# Altium project PCB_Project.PrjPcb
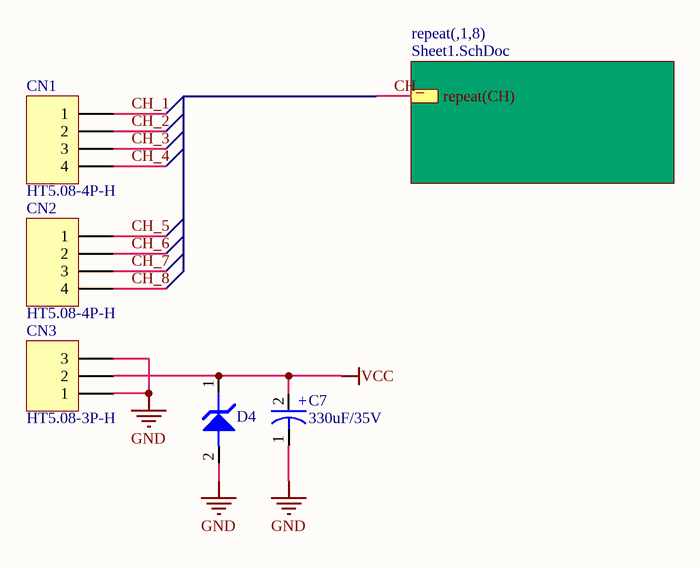
[diagram p0: Sheet2.SchDoc]
2 sheets, 69 parts. Net scope: hierarchical (ports join the sheet entries above them; power ports are global).
Board file: PCB1.PcbDoc
Sheets:
  Sheet2.SchDoc
    1 = Sheet1.SchDoc
    2 = Sheet1.SchDoc
    3 = Sheet1.SchDoc
    4 = Sheet1.SchDoc
    5 = Sheet1.SchDoc
    6 = Sheet1.SchDoc
    7 = Sheet1.SchDoc
    8 = Sheet1.SchDoc

## Sheet Sheet2.SchDoc
size A4

### Parts
C7  value 330uF/35V  [CA10X16P5]  (hidden comment: CAPACITOR 330uF 20% 35V 10mmX16mm)
CN1  HT5.08-4P-H  [HT5.08-4P-H]
CN2  HT5.08-4P-H  [HT5.08-4P-H]
CN3  HT5.08-3P-H  [HT5.08-3P-H]
D4  SMAJ5.0A  [SMA]  (value not drawn)

### Sub-sheets
repeat(,1,8) = Sheet1.SchDoc: repeat(CH)

### Nets
GND: C7.1 CN3.1 CN3.3 D4.2
VCC: C7.2 CN3.2 D4.1
CH_: sheet repeat(,1,8)/repeat(CH)
CH_1: CN1.1
CH_2: CN1.2
CH_3: CN1.3
CH_4: CN1.4
CH_5: CN2.1
CH_6: CN2.2
CH_7: CN2.3
CH_8: CN2.4

### Notes on the sheet
- (in symbol EC00095) +

### Library data of the parts
C7 = EC00095: CAP 35V 20% 330uF 10X16X0.6MM ROHS，7000hours; Manufacturer: NIPPON CHEMI-CON; Manufacturer P/N: EKY350ELL331MJ16S; ID: 95; Type: ****; HelpURL: \\192.168.1.3\Esh\Department\RD\CAD\Component\Capacitor\KY(105).pdf; P/N: EC00095
CN1 CN2 = Header 4: Header, 4-Pin; Manufacturer P/N: HT5.08-4 Bend; P/N: EE00005; Manufacturer: *
CN3 = Header 3: Header, 3-Pin; LatestRevisionDate: 17-Jul-2002; LatestRevisionNote: Re-released for DXP Platform.; Publisher: Altium Limited
D4 = ED00032: Manufacturer P/N: SMBJ15A; Manufacturer: Bourns; P/N: EE00002; Value: SMBJ15A; Type: ****

## Sheet Sheet1.SchDoc
size A4
Used 8 times, as channels 1, 2, 3, 4, 5, 6, 7, 8. Parts and nets are listed once, with the designators drawn on the sheet.
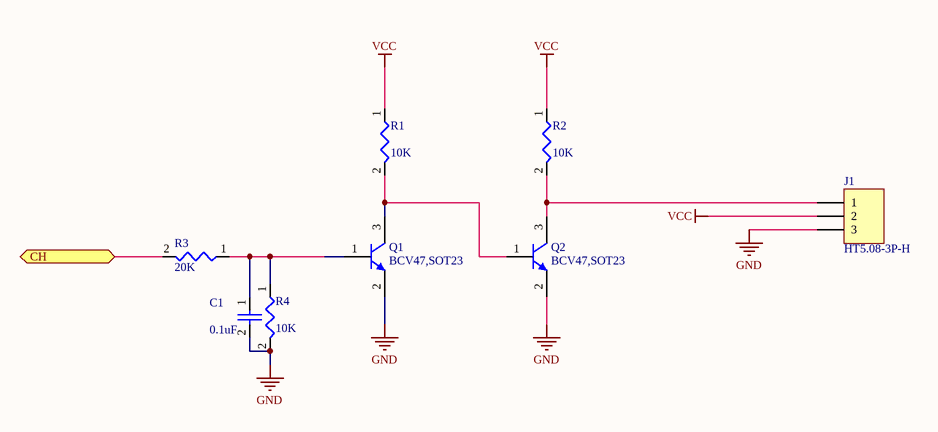
[diagram p1: Sheet1.SchDoc]

### Parts
C1  value 0.1uF  [C0805]  (hidden comment: CAP 0.1uF 50V 0805(2012))
J1  HT5.08-3P-H  [HT5.08-3P-H]
Q1  BCV47,SOT23  [INF-SOT23_L]
Q2  BCV47,SOT23  [INF-SOT23_L]
R1  value 10K  [R0805]  (hidden comment: RES 10K 5% 0805(2012))
R2  value 10K  [R0805]  (hidden comment: RES 10K 5% 0805(2012))
R3  value 20K  [R0805]  (hidden comment: RES 20K 5% 0805(2012))
R4  value 10K  [R0805]  (hidden comment: RES 10K 5% 0805(2012))

### Ports
CH

### Nets
GND: C1.2 J1.3 Q1.2(E) Q2.2(E) R4.2
VCC: J1.2 R1.1 R2.1
CH: R3.2 ; port CH
NetC1_1: C1.1 Q1.1(B) R3.1 R4.1
NetJ1_1: J1.1 Q2.3(C) R2.2
NetQ1_3: Q1.3(C) Q2.1(B) R1.2

### Channels
1: designators end in A; ports CH=CH_1
2: designators end in B; ports CH=CH_2
3: designators end in C; ports CH=CH_3
4: designators end in D; ports CH=CH_4
5: designators end in E; ports CH=CH_5
6: designators end in F; ports CH=CH_6
7: designators end in G; ports CH=CH_7
8: designators end in H; ports CH=CH_8

### Library data of the parts
C1 = EC00014: CAP SMD CR X7R 50V 10% 0.1uF 0805 ROHS; Manufacturer: YAGEO; Manufacturer P/N: CC0805KRX7R9BB104; ID: 14; HelpURL: *; P/N: EC00014
J1 = Header 3: Header, 3-Pin; LatestRevisionDate: 17-Jul-2002; LatestRevisionNote: Re-released for DXP Platform.; Publisher: Altium Limited
Q1 Q2 = CMP-1196-00014-1: NPN Silicon Darlington Transistor, 60 V VCEO, 500 mA IC, SOT23, Reel, Green; Manufacturer: Infineon; fT (typ): 170 MHz; IC (max): 500 mA; ICBO (max): 10 uA; Green: TRUE; VCE: 5 V; hFE (min): 2000; ICM (max): 800 mA; VCBO (max): 80 V; IC: 100 mA; VCEO (max): 60 V; VEBO (max): 10 V; ComponentLink1URL: http://www.infineon.com/; PackageVersion: Apr-08; ComponentLink2URL: http://www.infineon.com/dgdl/bcv27_bcv47.pdf?folderId=db3a30431441fb5d011445c30f210183&fileId=db3a30431441fb5d011445cf7c3b0188; ComponentLink2Description: Datasheet; ComponentLink1Description: Manufacturer URL; PartNumber: BCV47; Polarity: NPN; PackageReference: SOT23; PackageDescription: 3-Pin Small Outline Transistor Package, 1.3 x 2.9 mm Body, 0.95 mm Pitch; ComponentLink3URL: http://www.infineon.com/dgdl/SOT23-Package_Overview.pdf?folderId=db3a30431936bc4b0119532290053c66&fileId=db3a30431936bc4b0119533468123c85; Mounting Technology: Surface Mount; Packing: Reel; ComponentLink3Description: Package Specification
R1 R2 R4 = ER00213: RES THICK_FILM SMD 10K ohm 5% 1/10W ROHS 0603; Manufacturer: YAGEO; Manufacturer P/N: RC0603JR-1310KL; ID: 213; HelpURL: \\192.168.1.3\Esh\Department\RD\CAD\Component\Resistor\SMD\YAGEO_PYu-RC1206_51_RoHS_L_4.pdf; P/N: ER00213
R3 = ER00035: RES THICK_FILM SMD 100 OHM 5% 1/8W ROHS 0805; Manufacturer: YAGEO; Manufacturer P/N: RC0805JR-07100RL; ID: 35; HelpURL: *; P/N: ER00035

## Nets that join several sheets
GND: Sheet2 (C7.1 CN3.1 CN3.3 D4.2), 1 (5 pins), 2 (5 pins), 3 (5 pins), 4 (5 pins), 5 (5 pins), 6 (5 pins), 7 (5 pins), 8 (5 pins)
VCC: Sheet2 (C7.2 CN3.2 D4.1), 1 (J1A.2 R1A.1 R2A.1), 2 (J1B.2 R1B.1 R2B.1), 3 (J1C.2 R1C.1 R2C.1), 4 (J1D.2 R1D.1 R2D.1), 5 (J1E.2 R1E.1 R2E.1), 6 (J1F.2 R1F.1 R2F.1), 7 (J1G.2 R1G.1 R2G.1), 8 (J1H.2 R1H.1 R2H.1)
CH_1: Sheet2 (CN1.1), 1 (R3A.2)
CH_2: Sheet2 (CN1.2), 2 (R3B.2)
CH_3: Sheet2 (CN1.3), 3 (R3C.2)
CH_4: Sheet2 (CN1.4), 4 (R3D.2)
CH_5: Sheet2 (CN2.1), 5 (R3E.2)
CH_6: Sheet2 (CN2.2), 6 (R3F.2)
CH_7: Sheet2 (CN2.3), 7 (R3G.2)
CH_8: Sheet2 (CN2.4), 8 (R3H.2)